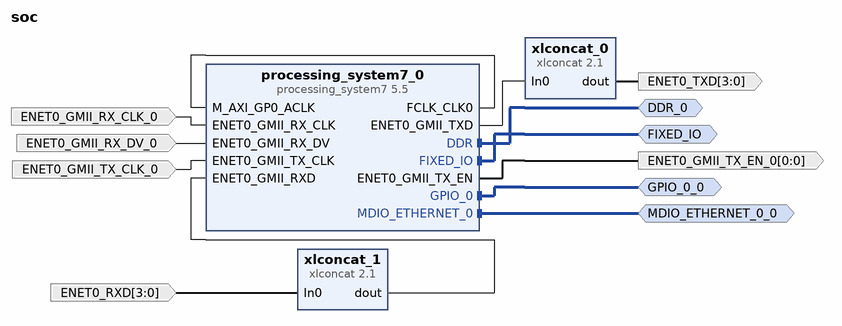
[diagram p0: block diagram of the top level]
# Vivado block design soc, xc7z010clg400-1, Vivado 2020.2
create_bd_design soc

create_bd_intf_port -mode Master -vlnv xilinx.com:interface:ddrx_rtl:1.0 DDR_0
create_bd_intf_port -mode Master -vlnv xilinx.com:display_processing_system7:fixedio_rtl:1.0 FIXED_IO
create_bd_intf_port -mode Master -vlnv xilinx.com:interface:gpio_rtl:1.0 GPIO_0_0
create_bd_intf_port -mode Master -vlnv xilinx.com:interface:mdio_rtl:1.0 MDIO_ETHERNET_0_0
create_bd_port -dir I -type clk ENET0_GMII_RX_CLK_0
create_bd_port -dir I ENET0_GMII_RX_DV_0
create_bd_port -dir I -type clk ENET0_GMII_TX_CLK_0
create_bd_port -dir O -from 0 -to 0 ENET0_GMII_TX_EN_0
create_bd_port -dir I -from 3 -to 0 ENET0_RXD
create_bd_port -dir O -from 3 -to 0 ENET0_TXD

create_bd_cell -type ip -vlnv xilinx.com:ip:processing_system7:5.5 processing_system7_0
set_property -dict [list \
  CONFIG.PCW_ENET0_ENET0_IO EMIO \
  CONFIG.PCW_ENET0_GRP_MDIO_ENABLE 1 \
  CONFIG.PCW_ENET0_GRP_MDIO_IO EMIO \
  CONFIG.PCW_ENET0_PERIPHERAL_ENABLE 1 \
  CONFIG.PCW_ENET0_PERIPHERAL_FREQMHZ {100 Mbps} \
  CONFIG.PCW_ENET0_RESET_ENABLE 0 \
  CONFIG.PCW_ENET_RESET_ENABLE 1 \
  CONFIG.PCW_ENET_RESET_SELECT {Share reset pin} \
  CONFIG.PCW_EN_RST0_PORT 0 \
  CONFIG.PCW_FCLK_CLK0_BUF FALSE \
  CONFIG.PCW_GPIO_EMIO_GPIO_ENABLE 1 \
  CONFIG.PCW_GPIO_EMIO_GPIO_IO 1 \
  CONFIG.PCW_GPIO_EMIO_GPIO_WIDTH 1 \
  CONFIG.PCW_GPIO_MIO_GPIO_ENABLE 1 \
  CONFIG.PCW_GPIO_MIO_GPIO_IO MIO \
  CONFIG.PCW_I2C_RESET_ENABLE 1 \
  CONFIG.PCW_SD0_GRP_CD_ENABLE 1 \
  CONFIG.PCW_SD0_GRP_CD_IO {MIO 47} \
  CONFIG.PCW_SD0_GRP_WP_ENABLE 0 \
  CONFIG.PCW_SD0_PERIPHERAL_ENABLE 1 \
  CONFIG.PCW_SD0_SD0_IO {MIO 40 .. 45} \
  CONFIG.PCW_SDIO_PERIPHERAL_FREQMHZ 10 \
  CONFIG.PCW_UART1_PERIPHERAL_ENABLE 1 \
  CONFIG.PCW_UART1_UART1_IO {MIO 24 .. 25} \
  CONFIG.PCW_UART_PERIPHERAL_FREQMHZ 100 \
  CONFIG.PCW_UIPARAM_DDR_BUS_WIDTH {16 Bit} \
  CONFIG.PCW_UIPARAM_DDR_FREQ_MHZ 533.333 \
  CONFIG.PCW_UIPARAM_DDR_PARTNO {MT41K256M16 RE-125} \
  CONFIG.PCW_USB_RESET_ENABLE 1 \
] [get_bd_cells processing_system7_0]
# 221 more settings of processing_system7_0 are not shown: defaults, MIO pin electricals, DDR timing, and values the tool derives
create_bd_cell -type ip -vlnv xilinx.com:ip:xlconcat:2.1 xlconcat_0
set_property -dict {CONFIG.IN0_WIDTH 4 CONFIG.NUM_PORTS 1} [get_bd_cells xlconcat_0]
create_bd_cell -type ip -vlnv xilinx.com:ip:xlconcat:2.1 xlconcat_1
set_property -dict {CONFIG.IN0_WIDTH 4 CONFIG.IN1_WIDTH 4} [get_bd_cells xlconcat_1]

# ---- connections ----

connect_bd_intf_net [get_bd_intf_ports FIXED_IO] [get_bd_intf_pins processing_system7_0/FIXED_IO]
connect_bd_intf_net [get_bd_intf_ports GPIO_0_0] [get_bd_intf_pins processing_system7_0/GPIO_0]
connect_bd_intf_net [get_bd_intf_ports DDR_0] [get_bd_intf_pins processing_system7_0/DDR]
connect_bd_intf_net [get_bd_intf_ports MDIO_ETHERNET_0_0] [get_bd_intf_pins processing_system7_0/MDIO_ETHERNET_0]
connect_bd_net -net ENET0_GMII_RX_CLK_0_1 [get_bd_ports ENET0_GMII_RX_CLK_0] [get_bd_pins processing_system7_0/ENET0_GMII_RX_CLK]
connect_bd_net -net ENET0_GMII_RX_DV_0_1 [get_bd_ports ENET0_GMII_RX_DV_0] [get_bd_pins processing_system7_0/ENET0_GMII_RX_DV]
connect_bd_net -net ENET0_GMII_TX_CLK_0_1 [get_bd_ports ENET0_GMII_TX_CLK_0] [get_bd_pins processing_system7_0/ENET0_GMII_TX_CLK]
connect_bd_net -net In0_0_1 [get_bd_ports ENET0_RXD] [get_bd_pins xlconcat_1/In0]
connect_bd_net [get_bd_pins processing_system7_0/ENET0_GMII_TXD] [get_bd_pins xlconcat_0/In0]
connect_bd_net [get_bd_pins processing_system7_0/ENET0_GMII_TX_EN] [get_bd_ports ENET0_GMII_TX_EN_0]
connect_bd_net [get_bd_pins processing_system7_0/FCLK_CLK0] [get_bd_pins processing_system7_0/M_AXI_GP0_ACLK]
connect_bd_net [get_bd_pins xlconcat_0/dout] [get_bd_ports ENET0_TXD]
connect_bd_net [get_bd_pins xlconcat_1/dout] [get_bd_pins processing_system7_0/ENET0_GMII_RXD]

validate_bd_design
save_bd_design
